# Altium schematic sheet I2C_Multiplexer.SchDoc: =DocumentName
size A3; Organization: ORGANIZATION; Address1: R. Aprígio Veloso, 882, Universitário; Address2: Campina Grande - PB; Address3: 58429-900; Revision: -; SheetNumber: 6; SheetTotal: 6; ENG_DATE: --/--/--; DSN_DATE: --/--/--; CHK_DATE: --/--/--; SCH_SCALE: 1:1
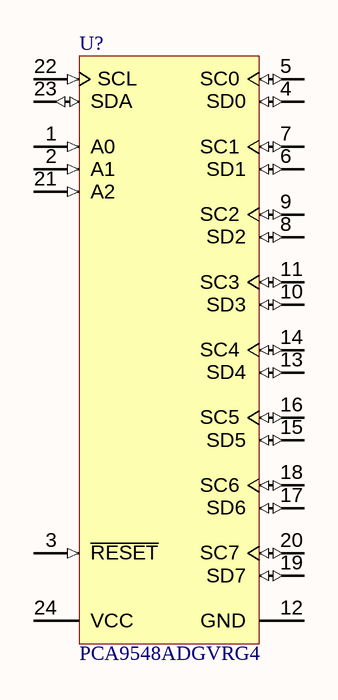
[diagram p0: I2C_Multiplexer.SchDoc]

## Parts
U?  PCA9548ADGVRG4  [DGV24_L]

## Nets

Not connected (* = marked no-connect by the designer): U? 1(A0) 2(A1) 3(~{RESET}) 4(SD0) 5(SC0) 6(SD1) 7(SC1) 8(SD2) 9(SC2) 10(SD3) 11(SC3) 12(GND) 13(SD4) 14(SC4) 15(SD5) 16(SC5) 17(SD6) 18(SC6) 19(SD7) 20(SC7) 21(A2) 22(SCL) 23(SDA) 24(VCC)

## Notes on the sheet
- REVISION
- DESCRIPTION
- DATE
- APPROVED
- ADDRESS
- PROJECT
- VERSION
- TITLE
- A3
- SIZE
- SCALE
- DOCUMENT NAME:
- DOCUMENT REVISION:
- OF
- SHEET:
- PROJECT REVISION:

## Library data of the parts
U? = CMP-0314-00398-1: 8-Channel I2C Switch with Reset, 2.3 to 5.5 V, -40 to 85 degC, 24-pin TVSOP (DGV), Green (RoHS & no Sb/Br); Manufacturer: Texas Instruments; I2C Address: 1110 xxx; Technology Family: PCA; Open Drain I/O Type: Yes; Max Frequency(kHz): 400; VCC(Max)(V): 5.5; fSCLK(Max)(MHz): 100, 400; SubFamily: I2C Multiplexer, Switch; Channel Width: 8; VCC(Min)(V): 2.3; Simultaneously Active Channels: 1 to 8; PartNumber: PCA9548ADGVRG4; ComponentLink2URL: http://www.ti.com/litv/pdf/mpds211a; ComponentLink2Description: Package Specification; 5V Tolerant I/O: Yes; DatasheetVersion: SCPS143C; ComponentLink1Description: Datasheet; PackageDescription: 24-Pin Thin Shrink Small Outline Package 0.4 mm Pitch; ComponentLink1URL: http://www.ti.com/general/docs/lit/getliterature.tsp?genericPartNumber=PCA9548A&fileType=pdf; Vcc range(V): 2.3 to 5.5; Mounting Technology: Surface Mount; Reset Input: Yes; Eco-Plan: Green (RoHS & no Sb/Br); PackageVersion: revE, Aug-2000; PackageReference: DGV24